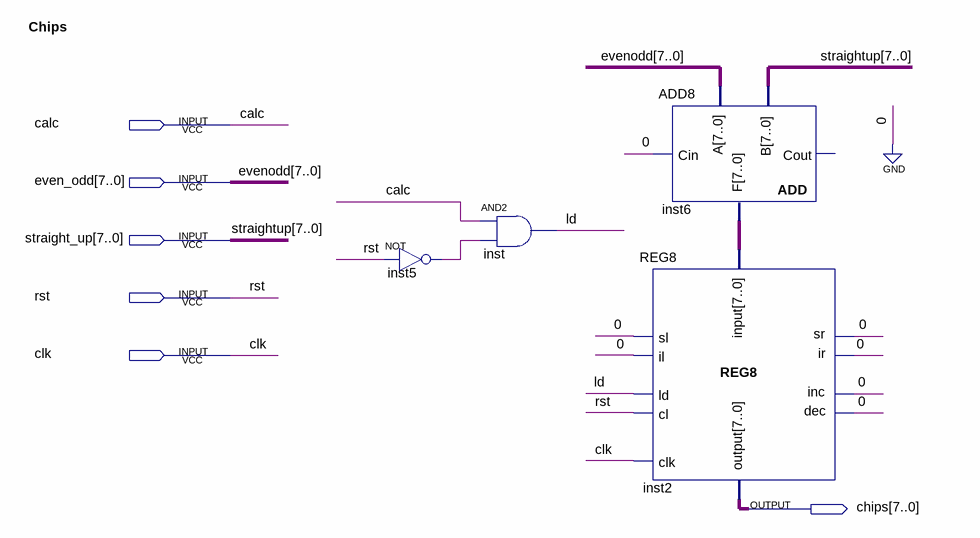
[diagram p0: schematic sheet]
// Quartus schematic Chips.bdf as structural Verilog: 4 symbols, 6 pins
module Chips (
  input  calc,
  input  [7:0] even_odd,
  input  [7:0] straight_up,
  input  rst,
  input  clk,
  output [7:0] chips
);

  wire inst5_out, ld;
  wire [7:0] inst6_f;

  not inst5 (inst5_out, rst);
  and inst (ld, calc, inst5_out);
  ADD8 inst6 (.A(even_odd), .B(straight_up), .Cin(1'b0), .F(inst6_f));  // open: Cout
  REG8 inst2 (
    .clk(clk), .ld(ld), .\input (inst6_f), .sr(1'b0), .ir(1'b0), .sl(1'b0), .il(1'b0), .inc(1'b0),
    .dec(1'b0), .cl(rst), .\output (chips));

  // Other names for the same wires on the sheet: evenodd[7:0] = even_odd; straightup[7:0] = straight_up

  // Notes on the sheet:
  //   Chips
endmodule
